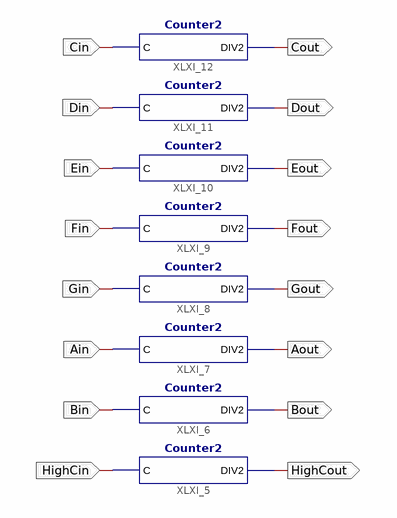
[diagram p0: schematic sheet 1]
// Xilinx ISE schematic DropOctave.sch (spartan6) as structural Verilog: 8 symbols, 16 ports
module DropOctave (
  input  Cin,
  input  Din,
  input  Ein,
  input  Fin,
  input  Gin,
  input  Ain,
  input  Bin,
  input  HighCin,
  output Bout,
  output HighCout,
  output Aout,
  output Gout,
  output Fout,
  output Eout,
  output Dout,
  output Cout
);

  Counter2 XLXI_5 (.C(HighCin), .DIV2(HighCout));
  Counter2 XLXI_6 (.C(Bin), .DIV2(Bout));
  Counter2 XLXI_7 (.C(Ain), .DIV2(Aout));
  Counter2 XLXI_8 (.C(Gin), .DIV2(Gout));
  Counter2 XLXI_9 (.C(Fin), .DIV2(Fout));
  Counter2 XLXI_10 (.C(Ein), .DIV2(Eout));
  Counter2 XLXI_11 (.C(Din), .DIV2(Dout));
  Counter2 XLXI_12 (.C(Cin), .DIV2(Cout));
endmodule
